# Altium schematic sheet Sheet5.SchDoc
size A3; SheetNumber: 1; SheetTotal: 1
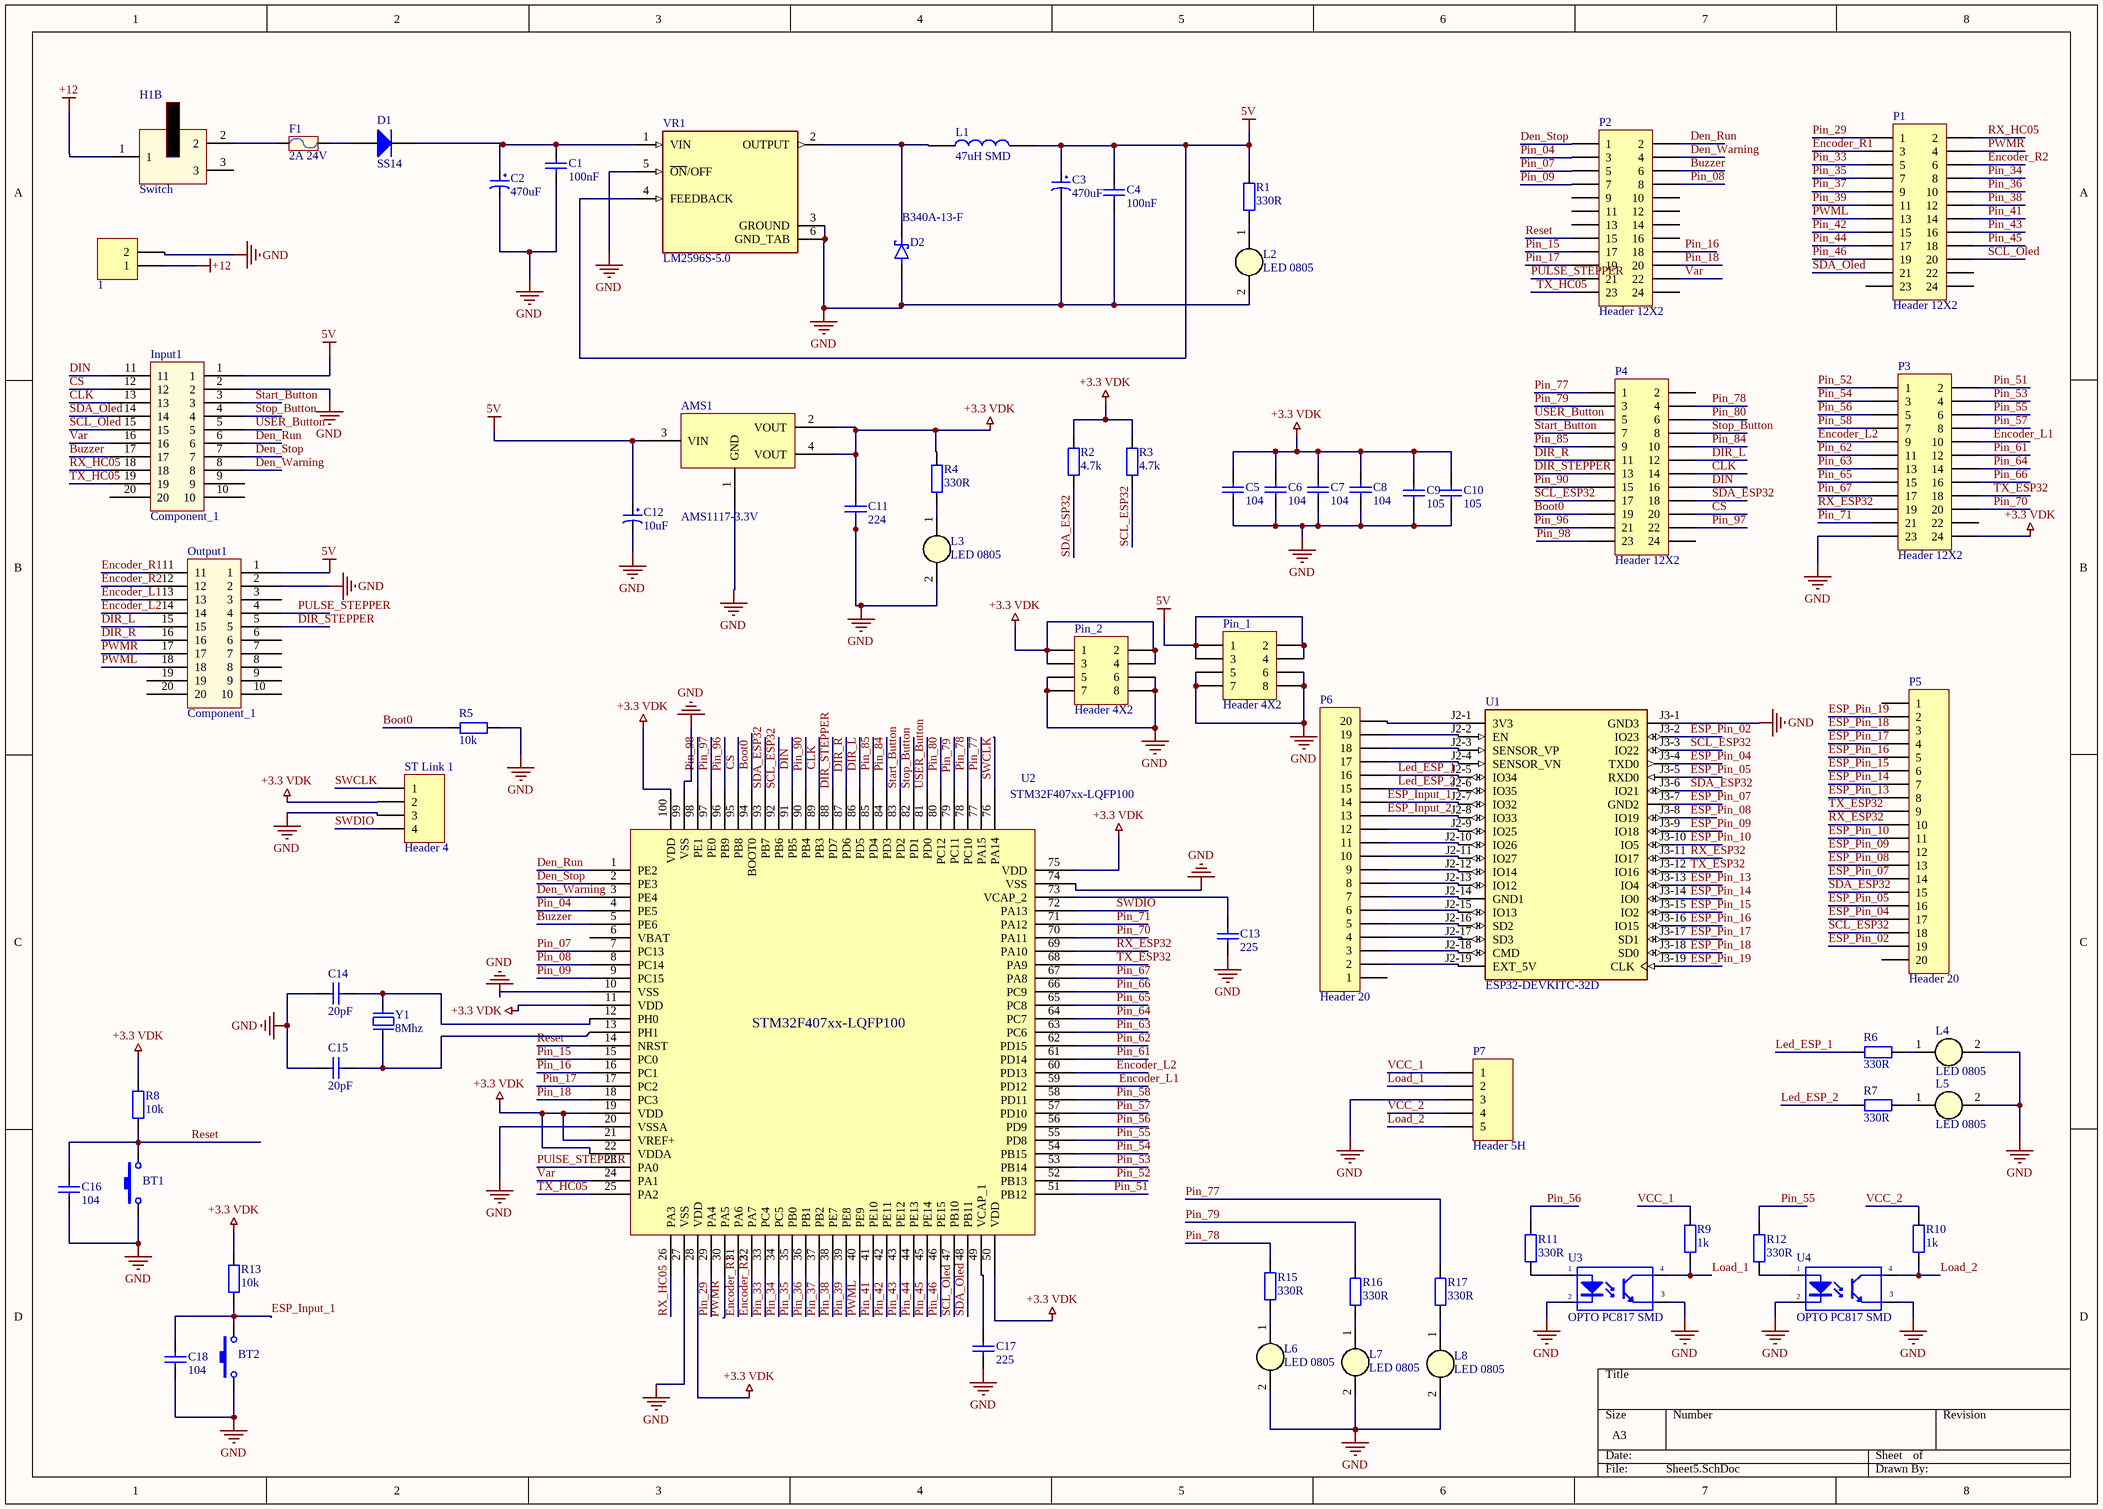
[diagram p0: Sheet5.SchDoc]

## Parts
1  Header 2_1  [HED2]  (value not drawn)
AMS1  AMS1117-3.3V  [SOT223]
BT1  Nut Nhan 2 Chan SMD 3x6x2.5  [Nut Nhan 2 Chan SMD 3x6x2.5]  (value not drawn)
BT2  Nut Nhan 2 Chan SMD 3x6x2.5  [Nut Nhan 2 Chan SMD 3x6x2.5]  (value not drawn)
C1  100nF  [tu tantalum dip5.08]
C2  470uF  [tu hoa 8mm]
C3  470uF  [tu hoa 8mm]
C4  100nF  [tu tantalum dip5.08]
C5  104  [tu 0805]
C6  104  [tu 0805]
C7  104  [tu 0805]
C8  104  [tu 0805]
C9  105  [tu 0805]
C10  105  [tu 0805]
C11  224  [tu 0805]
C12  10uF  [tu hoa 4mm]
C13  225  [tu 0805]
C14  20pF  [tu 0805]
C15  20pF  [tu 0805]
C16  104  [tu 0805]
C17  225  [tu 0805]
C18  104  [tu 0805]
D1  SS14  [DIODE SMA]
D2  B340A-13-F  [DIOM5226X240N]
F1  2A 24V  [Cau chi tu phuc hoi 2A 24V SMD1812]
H1  Switch  [Switch_10A]  (part B of 2)
Input1  Component_1  [PCBComponent_1]
L1  47uH SMD  [Cuon Cam 7x7x5]
L2  LED 0805  [LED-0805-Yellow]
L3  LED 0805  [LED-0805-Yellow]
L4  LED 0805  [LED-0805-Yellow]
L5  LED 0805  [LED-0805-Yellow]
L6  LED 0805  [LED-0805-Yellow]
L7  LED 0805  [LED-0805-Yellow]
L8  LED 0805  [LED-0805-Yellow]
Output1  Component_1  [PCBComponent_1]
P1  Header 12X2  [HDR2X12]
P2  Header 12X2  [HDR2X12]
P3  Header 12X2  [HDR2X12]
P4  Header 12X2  [HDR2X12]
P5  Header 20  [HDR1X20]
P6  Header 20  [HDR1X20]
P7  Header 5H  [HDR1X5H]
Pin_1  Header 4X2  [HDR2X4]
Pin_2  Header 4X2  [HDR2X4]
R1  330R  [Tro SMD 0805]
R2  4.7k  [tro smd 0805]
R3  4.7k  [tro smd 0805]
R4  330R  [Tro SMD 0805]
R5  10k  [tro smd 0805]
R6  330R  [Tro SMD 0805]
R7  330R  [Tro SMD 0805]
R8  10k  [tro smd 0805]
R9  1k  [tro smd 0805]
R10  1k  [tro smd 0805]
R11  330R  [Tro SMD 0805]
R12  330R  [Tro SMD 0805]
R13  10k  [tro smd 0805]
R15  330R  [Tro SMD 0805]
R16  330R  [Tro SMD 0805]
R17  330R  [Tro SMD 0805]
ST_Link_1  Header 4  [HDR1X4]
U1  ESP32-DEVKITC-32D  [MODULE_ESP32-DEVKITC-32D]
U2  STM32F407xx-LQFP100  [STM32_LQFP100]
U3  OPTO PC817 SMD  [SOP4]
U4  OPTO PC817 SMD  [SOP4]
VR1  LM2596S-5.0  [TO170P1524X483-6N]
Y1  8Mhz  [Thach Anh 2 chan SMD]

## Nets
5V: AMS1.3(VIN) C3.1 C4.1 C12.1 Input1.1 L1.2 Output1.1 Pin_1.1 Pin_1.2 Pin_1.3 Pin_1.4 R1.2 VR1.4(FEEDBACK)
+3.3 VDK: AMS1.2(VOUT) AMS1.4(VOUT) C5.1 C6.1 C7.1 C8.1 C9.1 C10.1 C11.1 P3.24 Pin_2.1 Pin_2.2 Pin_2.3 Pin_2.4 R2.2 R3.2 R4.2 R8.2 R13.2 ST_Link_1.2 U2.11(VDD) U2.19(VDD) U2.21(VREF+) U2.22(VDDA) U2.28(VDD) U2.50(VDD) U2.75(VDD) U2.100(VDD)
+12: 1.1 H1.1
GND: 1.2 AMS1.1(GND) BT1.1 BT2.1 C1.2 C2.2 C3.2 C4.2 C5.2 C6.2 C7.2 C8.2 C9.2 C10.2 C11.2 C12.2 C13.1 C14.2 C15.2 C16.2 C17.2 C18.2 D2.A Input1.2 L2.2(K) L3.2(K) L4.2(K) L5.2(K) L6.2(K) L7.2(K) L8.2(K) Output1.2 P3.23 P7.3 Pin_1.5 Pin_1.6 Pin_1.7 Pin_1.8 Pin_2.5 Pin_2.6 Pin_2.7 Pin_2.8 R5.2 ST_Link_1.3 U1.J3-1(GND3) U2.10(VSS) U2.20(VSSA) U2.27(VSS) U2.74(VSS) U2.99(VSS) U3.2(K) U3.3(E) U4.2(K) U4.3(E) VR1.3(GROUND) VR1.5(~{ON}/OFF) VR1.6(GND_TAB)
Boot0: P4.19 R5.1 U2.94(BOOT0)
Buzzer: Input1.17 P2.6 U2.5(PE6)
CLK: Input1.13 P4.14 U2.89(PB3)
CS: Input1.12 P4.20 U2.95(PB8)
Den_Run: Input1.6 P2.2 U2.1(PE2)
Den_Stop: Input1.7 P2.1 U2.2(PE3)
Den_Warning: Input1.8 P2.4 U2.3(PE4)
DIN: Input1.11 P4.16 U2.91(PB5)
DIR_L: Output1.15 P4.12 U2.86(PD5)
DIR_R: Output1.16 P4.11 U2.87(PD6)
DIR_STEPPER: Output1.5 P4.13 U2.88(PD7)
Encoder_L1: Output1.13 P3.10 U2.59(PD12)
Encoder_L2: Output1.14 P3.9 U2.60(PD13)
Encoder_R1: Output1.11 P1.3 U2.31(PA6)
Encoder_R2: Output1.12 P1.6 U2.32(PA7)
ESP_Input_1: BT2.2 C18.1 P6.14 R13.1 U1.J2-7(IO32)
ESP_Input_2: P6.13 U1.J2-8(IO33)
ESP_Pin_02: P5.19 U1.J3-2(IO23)
ESP_Pin_04: P5.17 U1.J3-4(TXD0)
ESP_Pin_05: P5.16 U1.J3-5(RXD0)
ESP_Pin_07: P5.14 U1.J3-7(GND2)
ESP_Pin_08: P5.13 U1.J3-8(IO19)
ESP_Pin_09: P5.12 U1.J3-9(IO18)
ESP_Pin_10: P5.11 U1.J3-10(IO5)
ESP_Pin_13: P5.8 U1.J3-13(IO4)
ESP_Pin_14: P5.7 U1.J3-14(IO0)
ESP_Pin_15: P5.6 U1.J3-15(IO2)
ESP_Pin_16: P5.5 U1.J3-16(IO15)
ESP_Pin_17: P5.4 U1.J3-17(SD1)
ESP_Pin_18: P5.3 U1.J3-18(SD0)
ESP_Pin_19: P5.2 U1.J3-19(CLK)
Led_ESP_1: P6.16 R6.2 U1.J2-5(IO34)
Led_ESP_2: P6.15 R7.2 U1.J2-6(IO35)
Load_1: P7.2 R9.1 U3.4(C)
Load_2: P7.5 R10.1 U4.4(C)
Pin_04: P2.3 U2.4(PE5)
Pin_07: P2.5 U2.7(PC13)
Pin_08: P2.8 U2.8(PC14)
Pin_09: P2.7 U2.9(PC15)
Pin_15: P2.17 U2.15(PC0)
Pin_16: P2.18 U2.16(PC1)
Pin_17: P2.19 U2.17(PC2)
Pin_18: P2.20 U2.18(PC3)
Pin_29: P1.1 U2.29(PA4)
Pin_33: P1.5 U2.33(PC4)
Pin_34: P1.8 U2.34(PC5)
Pin_35: P1.7 U2.35(PB0)
Pin_36: P1.10 U2.36(PB1)
Pin_37: P1.9 U2.37(PB2)
Pin_38: P1.12 U2.38(PE7)
Pin_39: P1.11 U2.39(PE8)
Pin_41: P1.14 U2.41(PE10)
Pin_42: P1.15 U2.42(PE11)
Pin_43: P1.16 U2.43(PE12)
Pin_44: P1.17 U2.44(PE13)
Pin_45: P1.18 U2.45(PE14)
Pin_46: P1.19 U2.46(PE15)
Pin_51: P3.2 U2.51(PB12)
Pin_52: P3.1 U2.52(PB13)
Pin_53: P3.4 U2.53(PB14)
Pin_54: P3.3 U2.54(PB15)
Pin_55: P3.6 R12.1 U2.55(PD8)
Pin_56: P3.5 R11.1 U2.56(PD9)
Pin_57: P3.8 U2.57(PD10)
Pin_58: P3.7 U2.58(PD11)
Pin_61: P3.12 U2.61(PD14)
Pin_62: P3.11 U2.62(PD15)
Pin_63: P3.13 U2.63(PC6)
Pin_64: P3.14 U2.64(PC7)
Pin_65: P3.15 U2.65(PC8)
Pin_66: P3.16 U2.66(PC9)
Pin_67: P3.17 U2.67(PA8)
Pin_70: P3.20 U2.70(PA11)
Pin_71: P3.21 U2.71(PA12)
Pin_77: P4.1 R17.2 U2.77(PA15)
Pin_78: P4.4 R15.2 U2.78(PC10)
Pin_79: P4.3 R16.2 U2.79(PC11)
Pin_80: P4.6 U2.80(PC12)
Pin_84: P4.10 U2.84(PD3)
Pin_85: P4.9 U2.85(PD4)
Pin_90: P4.15 U2.90(PB4)
Pin_96: P4.21 U2.96(PB9)
Pin_97: P4.22 U2.97(PE0)
Pin_98: P4.23 U2.98(PE1)
PUlSE_STEPPER: Output1.4 P2.21 U2.23(PA0)
PWML: Output1.18 P1.13 U2.40(PE9)
PWMR: Output1.17 P1.4 U2.30(PA5)
Reset: BT1.2 C16.1 P2.15 R8.1 U2.14(NRST)
RX_ESP32: P3.19 P5.10 U1.J3-11(IO17) U2.69(PA10)
RX_HC05: Input1.18 P1.2 U2.26(PA3)
SCL_ESP32: P4.17 P5.18 R3.1 U1.J3-3(IO22) U2.92(PB6)
SCL_Oled: Input1.15 P1.20 U2.47(PB10)
SDA_ESP32: P4.18 P5.15 R2.1 U1.J3-6(IO21) U2.93(PB7)
SDA_Oled: Input1.14 P1.21 U2.48(PB11)
Start_Button: Input1.3 P4.7 U2.83(PD2)
Stop_Button: Input1.4 P4.8 U2.82(PD1)
SWCLK: ST_Link_1.1 U2.76(PA14)
SWDIO: ST_Link_1.4 U2.72(PA13)
TX_ESP32: P3.18 P5.9 U1.J3-12(IO16) U2.68(PA9)
TX_HC05: Input1.19 P2.23 U2.25(PA2)
USER_Button: Input1.5 P4.5 U2.81(PD0)
Var: Input1.16 P2.22 U2.24(PA1)
VCC_1: P7.1 R9.2
VCC_2: P7.4 R10.2
NetC1_1: C1.1 C2.1 D1.2(K) VR1.1(VIN)
NetC13_2: C13.2 U2.73(VCAP_2)
NetC14_1: C14.1 U2.12(PH0) Y1.2
NetC15_1: C15.1 U2.13(PH1) Y1.1
NetC17_1: C17.1 U2.49(VCAP_1)
NetD1_1: D1.1(A) F1.2
NetD2_C: D2.C L1.1 VR1.2(OUTPUT)
NetF1_1: F1.1 H1.2
NetL2_1: L2.1(A) R1.1
NetL3_1: L3.1(A) R4.1
NetL4_1: L4.1(A) R6.1
NetL5_1: L5.1(A) R7.1
NetL6_1: L6.1(A) R15.1
NetL7_1: L7.1(A) R16.1
NetL8_1: L8.1(A) R17.1
NetP6_2: P6.2 U1.J2-19(EXT_5V)
NetP6_3: P6.3 U1.J2-18(CMD)
NetP6_4: P6.4 U1.J2-17(SD3)
NetP6_5: P6.5 U1.J2-16(SD2)
NetP6_6: P6.6 U1.J2-15(IO13)
NetP6_7: P6.7 U1.J2-14(GND1)
NetP6_8: P6.8 U1.J2-13(IO12)
NetP6_9: P6.9 U1.J2-12(IO14)
NetP6_10: P6.10 U1.J2-11(IO27)
NetP6_11: P6.11 U1.J2-10(IO26)
NetP6_12: P6.12 U1.J2-9(IO25)
NetP6_17: P6.17 U1.J2-4(SENSOR_VN)
NetP6_18: P6.18 U1.J2-3(SENSOR_VP)
NetP6_19: P6.19 U1.J2-2(EN)
NetP6_20: P6.20 U1.J2-1(3V3)
NetR11_2: R11.2 U3.1(A)
NetR12_2: R12.2 U4.1(A)

Not connected (* = marked no-connect by the designer): H1 3; Input1 9 10 20; Output1 3 6 7 8 9 10 19 20; P1 22 23 24; P2 9 10 11 12 13 14 16 24; P3 22; P4 2 24; P5 1 20; P6 1; U2 6(VBAT)

## Library data of the parts
1 = Header 2_1: Header, 2-Pin; Manufacturer: Generic Components; Class: Connector; Value: Header 2
AMS1 = AMS1117 SMD: Dán; Value: AMS1117-3.3V SOT223; Don_Vi: Con; Ma_Hang: MH000596; Ghi_Chu: *; Kieu_Chan: *; Chung_Loai: Dán
BT1 BT2 = Nut Nhan 2 Chan SMD 3x6x2.5: Ma_Hang: MH001036; Ten: Nút Nhấn 2 Chân 3x6x2.5MM SMD
C1 C4 = Tu tantalum 100nF 50V 20% DIP5.08: Cắm; Don_Vi: Con; So_Chan: 2; Ten_Linh_Kien: Tụ tantalum 104-100nF 50V 20% DIP5.08 (sứ vàng)(10PCS); Ma_Hang: MH003955; Chung_Loai: Cắm; Kieu_Chan: *
C2 C3 = Tu Hoa 470uF 16V 8x11: Cắm; Don_Vi: Con; So_Chan: 2; Ten_Linh_Kien: Tụ Hóa 470uF 16V 8x11MM; Ma_Hang: MH006550; Chung_Loai: Cắm; Kieu_Chan: *
C5-C8 C16 C18 = Tu 0805 104 50V 10%: Dán; Don_Vi: Con; So_Chan: 2; Ten_Linh_Kien: Tụ 0805 104-100nF 10% 50V; Ma_Hang: MH004551; Chung_Loai: Dán; Kieu_Chan: *
C9 C10 = Tu 0805 105 50V 10%: Dán; Don_Vi: Con; So_Chan: 2; Ten_Linh_Kien: Tụ 0805 105-1uF 10% 50V; Ma_Hang: MH004552; Chung_Loai: Dán; Kieu_Chan: *
C11 = Tu 0805 224 50V 10%: Dán; Don_Vi: Con; So_Chan: 2; Ten_Linh_Kien: Tụ 0805 224-0.22uF 10% 50V; Ma_Hang: MH004559; Chung_Loai: Dán; Kieu_Chan: *
C12 = Tu Hoa 10uF 25V 4x7: Cắm; So_Chan: 2; Ten_Linh_Kien: Tụ Hóa 10uF 25V 4x7MM; Don_Vi: Con; Ma_Hang: MH001349; Chung_Loai: Cắm; Kieu_Chan: *
C13 C17 = Tu 0805 225 25V 10%: Dán; Don_Vi: Con; So_Chan: 2; Ten_Linh_Kien: Tụ 0805 225-2.2uF 25V 10%; Ma_Hang: MH007483; Chung_Loai: Dán; Kieu_Chan: *
C14 C15 = Tu 0805 20pF 50V 10%: Dán; Don_Vi: Con; Ten_Linh_Kien: Tụ 0805 20P 10% 50V; So_Chan: 2; Ma_Hang: MH004558; Chung_Loai: Dán; Kieu_Chan: *
D1 = Diode SS14 ( 1N5819): Dán; Ma_Hang: MH002211; Don_Vi: Con; Ten_Linh_Kien: Diode SS14 DO214 Schottky 1A 40V ( 1N5819 DO214); Chung_Loai: Dán; Ghi_Chu: *; Kieu_Chan: *
D2 = B340A-13-F: Diode Schottky 40V 3A Surface Mount SMA; MF: Diodes Inc.; Availability: Unavailable; MP: B340A-13-F; Price: None; Value: *; SnapEDA_Link: https://www.snapeda.com/parts/B340A-13-F/Diodes%20Inc./view-part/78704/?ref=snap; Package: DO-214 Diodes Inc.
F1 = Cau chi tu phuc hoi 2A 24V SMD1812: 2A 24V SMD1812; Ma_Hang: MH010033; Ten: Cầu Chì Tự Phục Hồi 2A 24V SMD1812
H1 = Switch_2A
Input1 Output1 = Component_1: DC3_20pin
L1 = CUON CAM 47uH SMD: Dán; Don_Vi: Con; Ma_Hang: MH004211; Ten_Linh_Kien: Cuộn Cảm 47uH 7x7x4MM CD74R; Ghi_Chu: *; Kieu_Chan: *; Chung_Loai: Dán
L2-L8 = LED 0805 Trang: Dán; Don_Vi: Con; Ma_Hang: MH002946; Ten_Linh_Kien: LED 0805 Màu Trắng ( White); Ghi_Chu: *; Kieu_Chan: *; Chung_Loai: Dán
P1-P4 = Header 12X2: Header, 12-Pin, Dual row; LatestRevisionDate: 17-Jul-2002; LatestRevisionNote: Re-released for DXP Platform.; Publisher: Altium Limited
P5 P6 = Header 20: Header, 20-Pin; LatestRevisionDate: 17-Jul-2002; LatestRevisionNote: Re-released for DXP Platform.; Publisher: Altium Limited
P7 = Header 5H: Header, 5-Pin, Right Angle; LatestRevisionDate: 17-Jul-2002; LatestRevisionNote: Re-released for DXP Platform.; Publisher: Altium Limited
Pin_1 Pin_2 = Header 4X2: Header, 4-Pin, Dual row; LatestRevisionDate: 17-Jul-2002; LatestRevisionNote: Re-released for DXP Platform.; Publisher: Altium Limited
R1 R4 R6 R7 R11 R12 R15-R17 = Tro 0805 5% 330R: Dán; Don_Vi: Con; So_Chan: 2; Ten_Linh_Kien: Trở 0805 5% 330R; Ma_Hang: MH005337; Chung_Loai: Dán; Kieu_Chan: *
R2 R3 = Tro 0805 5% 4.7k: Dán; Don_Vi: Con; So_Chan: 2; Ten_Linh_Kien: Trở 0805 5% 4.7k; Ma_Hang: MH005307; Chung_Loai: Dán; Kieu_Chan: *
R5 R8 R13 = Tro 0805 5% 10k: Dán; Don_Vi: Con; So_Chan: 2; Ten_Linh_Kien: Trở 0805 5% 10k; Ma_Hang: MH005239; Chung_Loai: Dán; Kieu_Chan: *
R9 R10 = Tro 0805 1% 1k: Dán; Don_Vi: Con; So_Chan: 2; Ten_Linh_Kien: Trở 0805 1% 1k; Ma_Hang: MH005468; Chung_Loai: Dán; Kieu_Chan: *
ST_Link_1 = Header 4: Header, 4-Pin; LatestRevisionDate: 17-Jul-2002; LatestRevisionNote: Re-released for DXP Platform.; Publisher: Altium Limited
U1 = ESP32-DEVKITC-32D: WiFi Development Tools (802.11) ESP32 General Development Kit, ESP32-WROOM-32D on the board; MF: Espressif Systems; SnapEDA_Link: https://www.snapeda.com/parts/ESP32-DEVKITC-32D/Espressif+Systems/view-part/?ref=snap; Package: None; Value: *; MP: ESP32-DEVKITC-32D; Check_prices: https://www.snapeda.com/parts/ESP32-DEVKITC-32D/Espressif+Systems/view-part/?ref=eda
U3 U4 = OPTO PC817 SMD: Single Opto; Value: PC817
VR1 = LM2596S-5.0: SIMPLE SWITCHER&reg; 4.5V to 40V, 3A Low Component Count Step-Down Regulator; MP: LM2596S-5.0/NOPB; MF: Texas Instruments; Price: None; Availability: In Stock; Package: TO-263-5 Texas Instruments; SnapEDA_Link: https://www.snapeda.com/parts/LM2596S-5.0/NOPB/Texas+Instruments/view-part/?ref=snap; Check_prices: https://www.snapeda.com/parts/LM2596S-5.0/NOPB/Texas+Instruments/view-part/?ref=eda; Value: *; Purchase-URL: https://pricing.snapeda.com/search/part/LM2596S-5.0/NOPB/?ref=eda
Y1 = Thach Anh 2 chan SMD: Crystal For all Crystal 2pin.; Value: 4Mhz